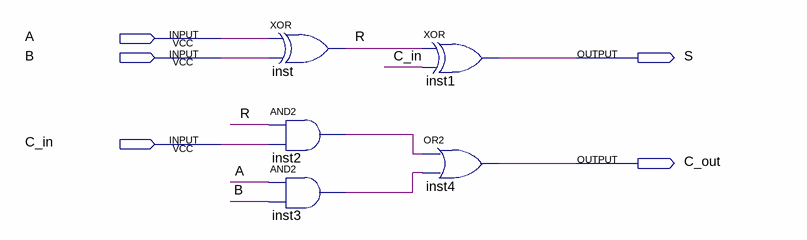
[diagram p0: schematic sheet]
// Quartus schematic FA.bdf as structural Verilog: 5 symbols, 5 pins
module FA (
  input  A,
  input  B,
  input  C_in,
  output S,
  output C_out
);

  wire inst2_out, inst3_out, R;

  xor inst (R, A, B);
  and inst2 (inst2_out, R, C_in);
  and inst3 (inst3_out, A, B);
  xor inst1 (S, R, C_in);
  or inst4 (C_out, inst2_out, inst3_out);
endmodule
